# Altium schematic sheet Pre-Proj-Sch.SchDoc
size A
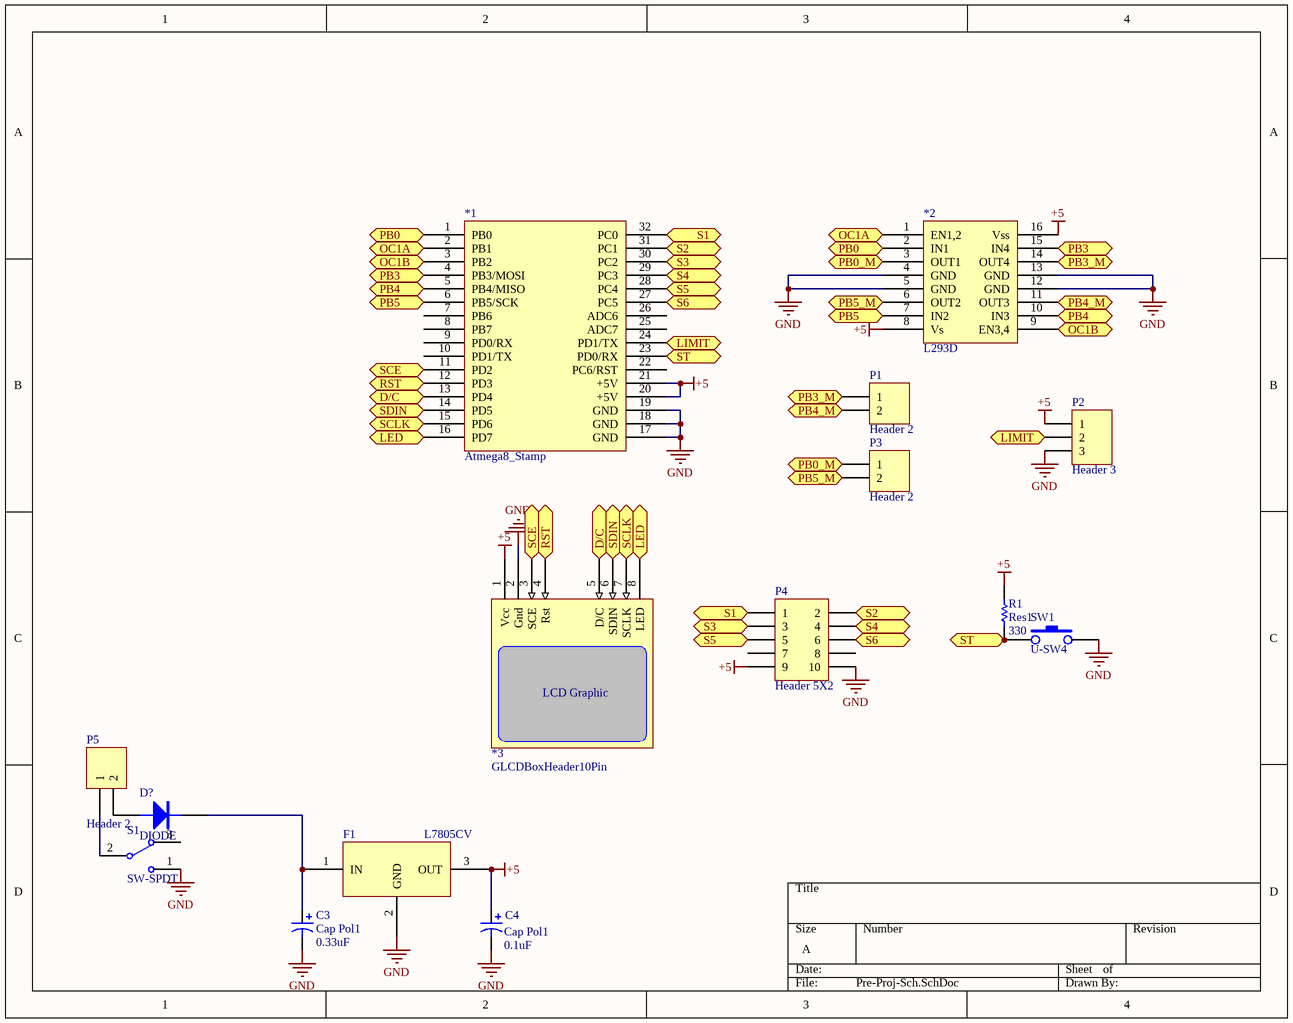
[diagram p0: Pre-Proj-Sch.SchDoc]

## Parts
*1  Atmega8_Stamp  [Atmega8_Stamp]
*2  L293D  [dip-16]
*3  GLCDBoxHeader10Pin  [GLCDBoxHeader10Pin]
C3  Cap Pol1  value 0.33uF  [CAPPR2-5x6.8]
C4  Cap Pol1  value 0.1uF  [CAPPR2-5x6.8]
D?  DIODE  [diode]
F1  L7805CV  [78xx]
P1  Header 2  [HDR1X2]
P2  Header 3  [HDR1X3]
P3  Header 2  [HDR1X2]
P4  Header 5X2  [HDR2X5]
P5  Header 2  [HDR1X2]
R1  Res1  value 330  [AXIAL-0.3]
S1  SW-SPDT  [HDR1X3]
SW1  U-SW4  [u-sw4]

## Ports
D/C (bidir), LED (bidir), LIMIT (bidir), OC1A (bidir), OC1B (bidir), PB0 (bidir), PB0_M (bidir), PB3 (bidir), PB3_M (bidir), PB4 (bidir), PB4_M (bidir), PB5 (bidir), PB5_M (bidir), RST (bidir), S1 (bidir), S2 (bidir), S3 (bidir), S4 (bidir), S5 (bidir), S6 (bidir), SCE (bidir), SCLK (bidir), SDIN (bidir), ST (bidir)

## Nets
+5: *1.20(+5V) *1.21(+5V) *2.8(Vs) *2.16(Vss) *3.1(Vcc) C4.1 F1.3(OUT) P2.1 P4.9 R1.2
GND: *1.17(GND) *1.18(GND) *1.19(GND) *2.4(GND) *2.5(GND) *2.12(GND) *2.13(GND) *3.2(Gnd) C3.2 C4.2 F1.2(GND) P2.3 P4.10 S1.1 SW1.2
D/C: *1.13(PD4) *3.5(D/C) ; port D/C
LED: *1.16(PD7) *3.8(LED) ; port LED
LIMIT: *1.24(PD1/TX) P2.2 ; port LIMIT
OC1A: *1.2(PB1) *2.1(EN1,2) ; port OC1A
OC1B: *1.3(PB2) *2.9(EN3,4) ; port OC1B
PB0: *1.1(PB0) *2.2(IN1) ; port PB0
PB0_M: *2.3(OUT1) P3.1 ; port PB0_M
PB3: *1.4(PB3/MOSI) *2.15(IN4) ; port PB3
PB3_M: *2.14(OUT4) P1.1 ; port PB3_M
PB4: *1.5(PB4/MISO) *2.10(IN3) ; port PB4
PB4_M: *2.11(OUT3) P1.2 ; port PB4_M
PB5: *1.6(PB5/SCK) *2.7(IN2) ; port PB5
PB5_M: *2.6(OUT2) P3.2 ; port PB5_M
RST: *1.12(PD3) *3.4(Rst) ; port RST
S1: *1.32(PC0) P4.1 ; port S1
S2: *1.31(PC1) P4.2 ; port S2
S3: *1.30(PC2) P4.3 ; port S3
S4: *1.29(PC3) P4.4 ; port S4
S5: *1.28(PC4) P4.5 ; port S5
S6: *1.27(PC5) P4.6 ; port S6
SCE: *1.11(PD2) *3.3(SCE) ; port SCE
SCLK: *1.15(PD6) *3.7(SCLK) ; port SCLK
SDIN: *1.14(PD5) *3.6(SDIN) ; port SDIN
ST: *1.23(PD0/RX) R1.1 SW1.1 ; port ST
NetC3_1: C3.1 D?.2(K) F1.1(IN)
NetD?_1: D?.1(A) P5.2
NetP5_1: P5.1 S1.2

Not connected (* = marked no-connect by the designer): *1 7(PB6) 8(PB7) 9(PD0/RX) 10(PD1/TX) 22(PC6/RST) 25(ADC7) 26(ADC6); P4 7 8; S1 3

## Notes on the sheet
- (in symbol GLCDBoxHeader10Pin) LCD Graphic

## Library data of the parts
C3 C4 = Cap Pol1: Polarized Capacitor (Radial); Published: 8-Jun-2000; LatestRevisionDate: 17-Jul-2002; LatestRevisionNote: Re-released for DXP Platform.; PackageReference: RB7.6-15; Publisher: Altium Limited
F1 = 78XX
P1 P3 P5 = Header 2: Header, 2-Pin; LatestRevisionDate: 17-Jul-2002; LatestRevisionNote: Re-released for DXP Platform.; Publisher: Altium Limited
P2 = Header 3: Header, 3-Pin; LatestRevisionDate: 17-Jul-2002; LatestRevisionNote: Re-released for DXP Platform.; Publisher: Altium Limited
P4 = Header 5X2: Header, 5-Pin, Dual row; LatestRevisionDate: 17-Jul-2002; LatestRevisionNote: Re-released for DXP Platform.; Publisher: Altium Limited
R1 = Res1: Resistor; Published: 8-Jun-2000; LatestRevisionDate: 17-Jul-2002; LatestRevisionNote: Re-released for DXP Platform.; PackageReference: AXIAL-0.3; Publisher: Altium Limited
S1 = SW-SPDT: SPDT Subminiature Toggle Switch, Right Angle Mounting, Vertical Actuation; Published: 24-Mar-1999; LatestRevisionDate: 17-Dec-2003; LatestRevisionNote: Schematic revised, PCB Footprint replaced.; DatasheetVersion: 05-Dec-2000; PackageReference: TL36WW15050; Publisher: Altium Limited; ComponentLink1Description: Manufacturer Link; ComponentLink1URL: http://www.apem.com